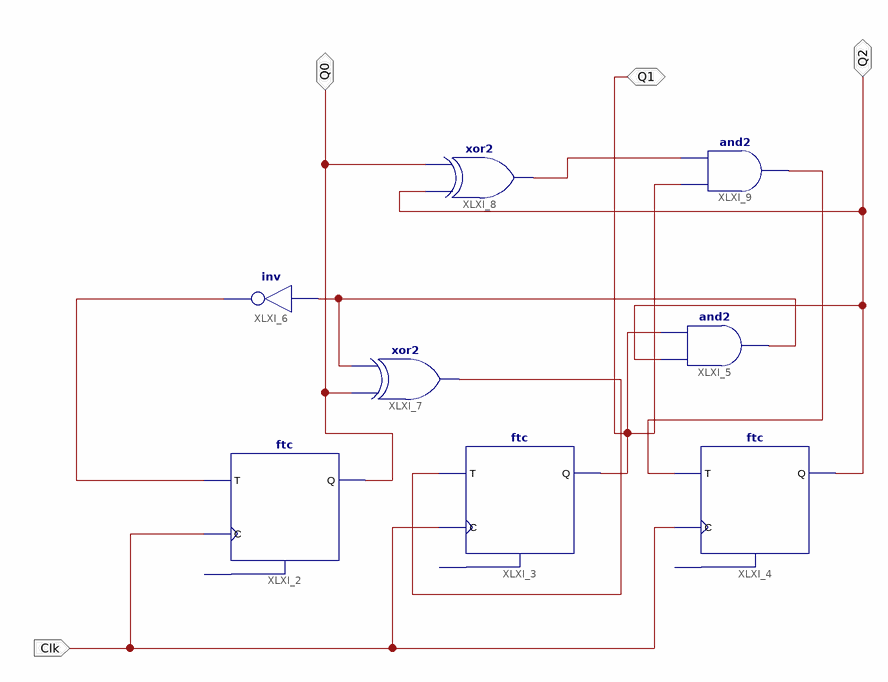
[diagram p0: schematic sheet 1]
// Xilinx ISE schematic mod7Counter.sch (spartan3) as structural Verilog: 8 symbols, 4 ports
module mod7Counter (
  input  Clk,
  inout  Q0,
  inout  Q2,
  inout  Q1
);

  wire XLXN_9, XLXN_10, XLXN_12, XLXN_13, XLXN_15;

  ftc XLXI_2 (.C(Clk), .T(XLXN_9), .Q(Q0));  // open: CLR
  ftc XLXI_3 (.C(Clk), .T(XLXN_12), .Q(Q1));  // open: CLR
  ftc XLXI_4 (.C(Clk), .T(XLXN_13), .Q(Q2));  // open: CLR
  and XLXI_5 (XLXN_10, Q2, Q1);
  not XLXI_6 (XLXN_9, XLXN_10);
  xor XLXI_7 (XLXN_12, Q0, XLXN_10);
  xor XLXI_8 (XLXN_15, Q2, Q0);
  and XLXI_9 (XLXN_13, Q1, XLXN_15);
endmodule
